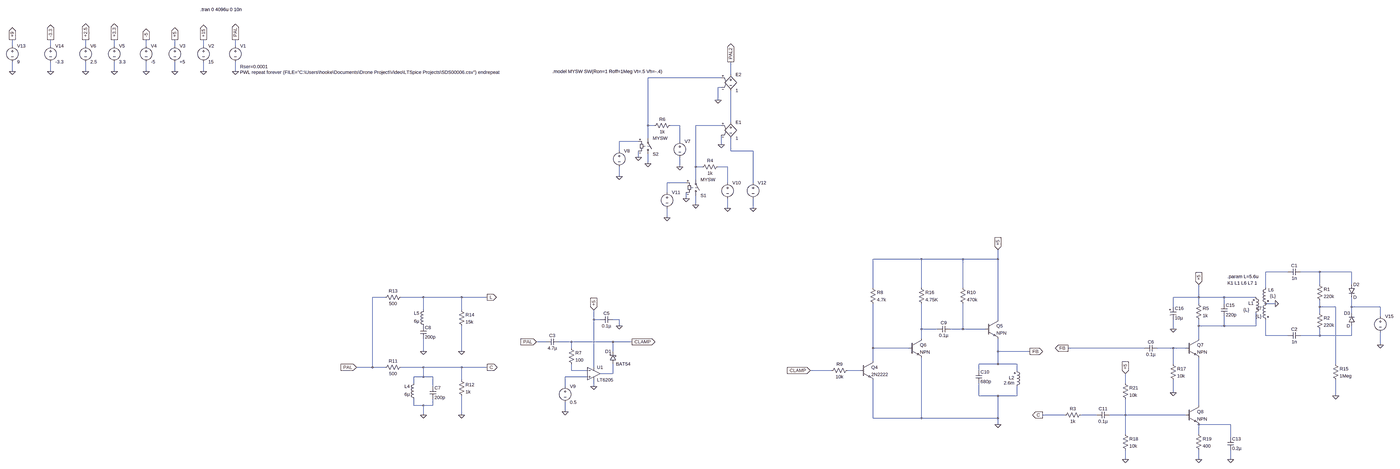
[diagram p0: schematic Burst_Pulse_Seperation.asc, whole sheet]
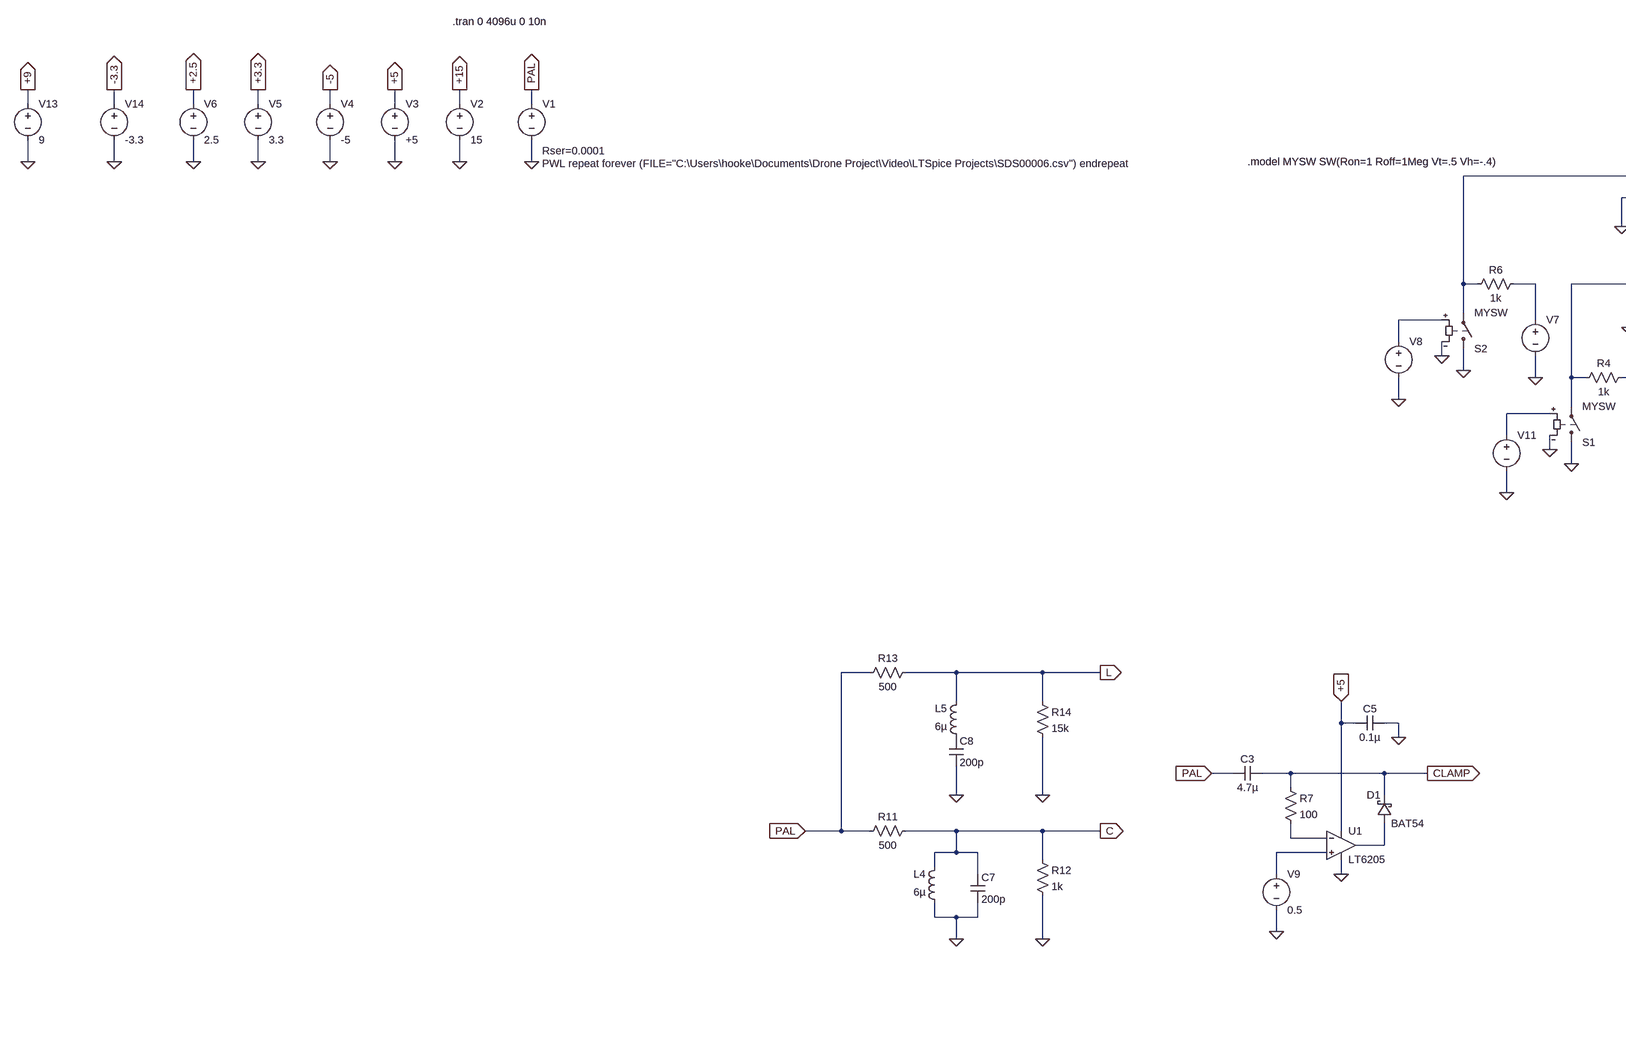
[diagram p1: schematic Burst_Pulse_Seperation.asc, part, row 1 of 1, column 1 of 2]
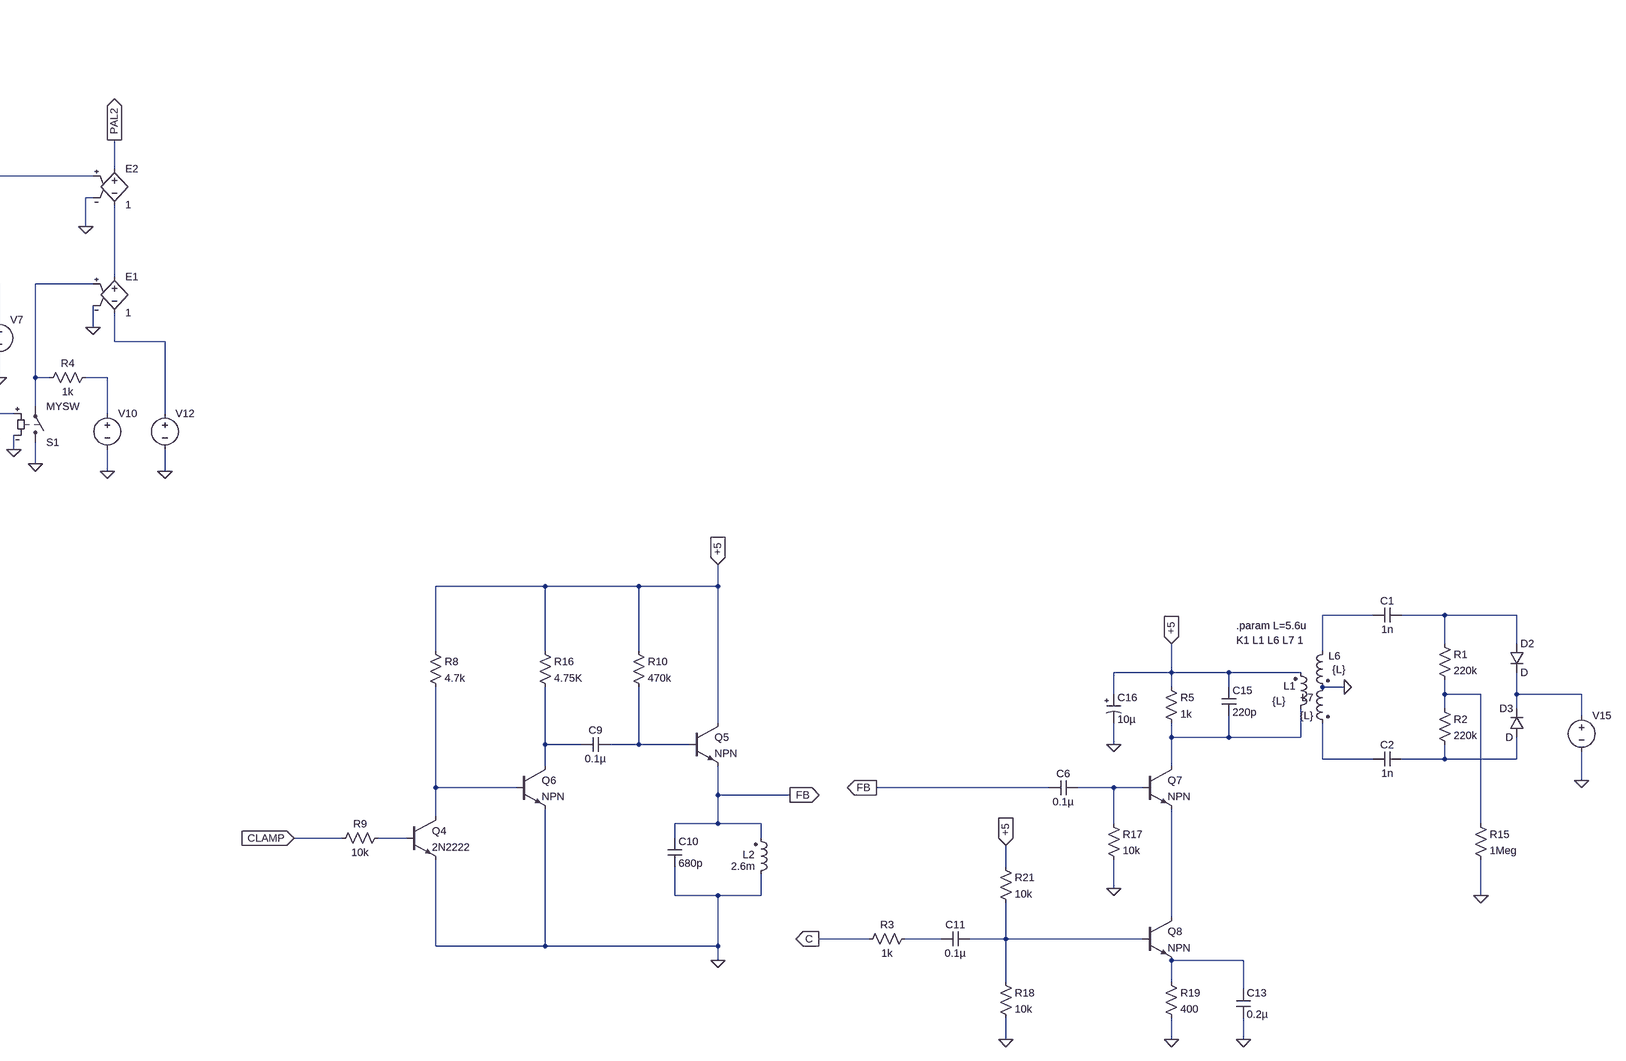
[diagram p2: schematic Burst_Pulse_Seperation.asc, part, row 1 of 1, column 2 of 2]
Burst_Pulse_Seperation.asc, the LTspice schematic file:
Version 4
SHEET 1 5768 2052
WIRE -2752 -704 -2752 -736
WIRE -2560 -704 -2560 -736
WIRE -2384 -704 -2384 -736
WIRE -2240 -704 -2240 -736
WIRE -2080 -704 -2080 -736
WIRE -1936 -704 -1936 -736
WIRE -1792 -704 -1792 -736
WIRE -1632 -704 -1632 -736
WIRE -2752 -576 -2752 -624
WIRE -2560 -576 -2560 -624
WIRE -2384 -576 -2384 -624
WIRE -2240 -576 -2240 -624
WIRE -2080 -576 -2080 -624
WIRE -1936 -576 -1936 -624
WIRE -1792 -576 -1792 -624
WIRE -1632 -576 -1632 -624
WIRE 1264 -560 1264 -624
WIRE 1216 -544 848 -544
WIRE 1216 -496 1200 -496
WIRE 1200 -432 1200 -496
WIRE 1264 -320 1264 -480
WIRE 848 -304 848 -544
WIRE 880 -304 848 -304
WIRE 1008 -304 960 -304
WIRE 1216 -304 1088 -304
WIRE 848 -240 848 -304
WIRE 800 -224 704 -224
WIRE 1008 -224 1008 -304
WIRE 1216 -208 1216 -256
WIRE 704 -176 704 -224
WIRE 1264 -176 1264 -240
WIRE 1376 -176 1264 -176
WIRE 800 -144 800 -176
WIRE 848 -112 848 -160
WIRE 1008 -96 1008 -144
WIRE 1088 -96 1088 -304
WIRE 1120 -96 1088 -96
WIRE 1248 -96 1200 -96
WIRE 704 -48 704 -96
WIRE 1088 -32 1088 -96
WIRE 1040 -16 944 -16
WIRE 1248 -16 1248 -96
WIRE 1376 -16 1376 -176
WIRE 944 32 944 -16
WIRE 1040 64 1040 32
WIRE 1088 96 1088 48
WIRE 1248 112 1248 64
WIRE 1376 112 1376 64
WIRE 944 160 944 112
WIRE 3280 368 3008 368
WIRE 3488 368 3280 368
WIRE 3664 368 3664 320
WIRE 3664 368 3488 368
WIRE 5120 432 5008 432
WIRE 5280 432 5184 432
WIRE 5440 432 5280 432
WIRE 5280 496 5280 432
WIRE 5440 496 5440 432
WIRE 3008 512 3008 368
WIRE 3280 512 3280 368
WIRE 3488 512 3488 368
WIRE 5008 512 5008 432
WIRE -880 560 -944 560
WIRE -688 560 -800 560
WIRE -496 560 -688 560
WIRE -368 560 -496 560
WIRE 4672 560 4672 496
WIRE 4672 560 4544 560
WIRE 4800 560 4672 560
WIRE 4960 560 4800 560
WIRE 4672 592 4672 560
WIRE 4800 592 4800 560
WIRE 5056 592 5008 592
WIRE 4544 608 4544 560
WIRE 5280 608 5280 576
WIRE 5360 608 5280 608
WIRE 5440 608 5440 560
WIRE 5584 608 5440 608
WIRE -688 624 -688 560
WIRE -496 624 -496 560
WIRE 5280 640 5280 608
WIRE 5440 640 5440 608
WIRE 5584 656 5584 608
WIRE 576 672 576 624
WIRE 608 672 576 672
WIRE 704 672 672 672
WIRE 3664 672 3664 368
WIRE 704 704 704 672
WIRE 4672 704 4672 672
WIRE 4800 704 4800 656
WIRE 4800 704 4672 704
WIRE 4960 704 4960 640
WIRE 4960 704 4800 704
WIRE 3280 720 3280 592
WIRE 3360 720 3280 720
WIRE 3488 720 3488 592
WIRE 3488 720 3424 720
WIRE 3600 720 3488 720
WIRE 4544 720 4544 672
WIRE 5008 752 5008 672
WIRE 5120 752 5008 752
WIRE 5280 752 5280 720
WIRE 5280 752 5184 752
WIRE 5440 752 5440 704
WIRE 5440 752 5280 752
WIRE 3280 768 3280 720
WIRE 4672 768 4672 704
WIRE 336 784 288 784
WIRE 464 784 400 784
WIRE 672 784 464 784
WIRE 768 784 672 784
WIRE 5584 800 5584 736
WIRE 464 816 464 784
WIRE 3008 816 3008 592
WIRE 3216 816 3008 816
WIRE 4400 816 4016 816
WIRE 4544 816 4464 816
WIRE 4608 816 4544 816
WIRE -688 832 -688 768
WIRE -496 832 -496 704
WIRE 672 832 672 784
WIRE 3664 832 3664 768
WIRE 3824 832 3664 832
WIRE 3008 880 3008 816
WIRE 3664 896 3664 832
WIRE 3664 896 3568 896
WIRE 3760 896 3664 896
WIRE 4544 896 4544 816
WIRE 5360 896 5360 608
WIRE -944 912 -944 560
WIRE -944 912 -1024 912
WIRE -880 912 -944 912
WIRE -688 912 -800 912
WIRE -496 912 -688 912
WIRE -368 912 -496 912
WIRE 576 912 576 672
WIRE 464 928 464 896
WIRE 544 928 464 928
WIRE 2800 928 2688 928
WIRE 2944 928 2880 928
WIRE 3568 928 3568 896
WIRE 3760 928 3760 896
WIRE 672 944 672 896
WIRE 672 944 608 944
WIRE -688 960 -688 912
WIRE -688 960 -736 960
WIRE -640 960 -688 960
WIRE 544 960 432 960
WIRE -496 976 -496 912
WIRE -736 992 -736 960
WIRE 4304 992 4304 944
WIRE -640 1008 -640 960
WIRE 432 1008 432 960
WIRE 576 1008 576 976
WIRE 4544 1040 4544 976
WIRE 3568 1056 3568 992
WIRE 3664 1056 3568 1056
WIRE 3760 1056 3760 1008
WIRE 3760 1056 3664 1056
WIRE 5360 1056 5360 976
WIRE -736 1104 -736 1072
WIRE -688 1104 -736 1104
WIRE -640 1104 -640 1072
WIRE -640 1104 -688 1104
WIRE 4672 1104 4672 864
WIRE 432 1136 432 1088
WIRE -688 1152 -688 1104
WIRE -496 1152 -496 1056
WIRE 4000 1152 3888 1152
WIRE 4160 1152 4080 1152
WIRE 4304 1152 4304 1072
WIRE 4304 1152 4224 1152
WIRE 4608 1152 4304 1152
WIRE 3008 1168 3008 976
WIRE 3280 1168 3280 864
WIRE 3280 1168 3008 1168
WIRE 3664 1168 3664 1056
WIRE 3664 1168 3280 1168
WIRE 3664 1200 3664 1168
WIRE 4832 1200 4672 1200
WIRE 4304 1248 4304 1152
WIRE 4672 1248 4672 1200
WIRE 4832 1264 4832 1200
WIRE 4304 1376 4304 1328
WIRE 4672 1376 4672 1328
WIRE 4832 1376 4832 1328
FLAG -688 1152 0
FLAG -688 832 0
FLAG -496 1152 0
FLAG -496 832 0
FLAG -368 560 L
IOPIN -368 560 Out
FLAG -368 912 C
IOPIN -368 912 Out
FLAG -1632 -736 PAL
IOPIN -1632 -736 Out
FLAG -1632 -576 0
FLAG -1792 -736 +15
IOPIN -1792 -736 Out
FLAG -1792 -576 0
FLAG -1936 -736 +5
IOPIN -1936 -736 Out
FLAG -1936 -576 0
FLAG -2080 -736 -5
IOPIN -2080 -736 Out
FLAG -2080 -576 0
FLAG -2240 -736 +3.3
IOPIN -2240 -736 Out
FLAG -2240 -576 0
FLAG -2384 -736 +2.5
IOPIN -2384 -736 Out
FLAG -2384 -576 0
FLAG 1248 112 0
FLAG 1040 64 0
FLAG 944 160 0
FLAG 1088 96 0
FLAG 1216 -208 0
FLAG 1376 112 0
FLAG 1264 -624 PAL2
IOPIN 1264 -624 Out
FLAG -2560 -736 -3.3
IOPIN -2560 -736 Out
FLAG -2560 -576 0
FLAG 1008 -96 0
FLAG 800 -144 0
FLAG 704 -48 0
FLAG 848 -112 0
FLAG 1200 -432 0
FLAG 704 704 0
FLAG 576 1008 0
FLAG 288 784 PAL
IOPIN 288 784 In
FLAG 576 624 +5
IOPIN 576 624 In
FLAG 432 1136 0
FLAG -1024 912 PAL
IOPIN -1024 912 In
FLAG -2752 -736 +9
IOPIN -2752 -736 Out
FLAG -2752 -576 0
FLAG 3664 320 +5
IOPIN 3664 320 In
FLAG 3664 1200 0
FLAG 3824 832 FB
IOPIN 3824 832 Out
FLAG 768 784 CLAMP
IOPIN 768 784 Out
FLAG 2688 928 CLAMP
IOPIN 2688 928 In
FLAG 4016 816 FB
IOPIN 4016 816 Out
FLAG 4544 1040 0
FLAG 4304 1376 0
FLAG 4672 1376 0
FLAG 3888 1152 C
IOPIN 3888 1152 Out
FLAG 4672 496 +5
IOPIN 4672 496 In
FLAG 4304 944 +5
IOPIN 4304 944 In
FLAG 5056 592 0
FLAG 4832 1376 0
FLAG 4544 720 0
FLAG 5584 800 0
FLAG 5360 1056 0
SYMBOL ind -720 1088 R180
WINDOW 0 36 80 Left 2
WINDOW 3 36 40 Left 2
SYMATTR InstName L4
SYMATTR Value 6µ
SYMBOL cap -656 1008 R0
SYMATTR InstName C7
SYMATTR Value 200p
SYMBOL res -784 896 R90
WINDOW 0 0 56 VBottom 2
WINDOW 3 32 56 VTop 2
SYMATTR InstName R11
SYMATTR Value 500
SYMBOL res -512 960 R0
SYMATTR InstName R12
SYMATTR Value 1k
SYMBOL res -784 544 R90
WINDOW 0 0 56 VBottom 2
WINDOW 3 32 56 VTop 2
SYMATTR InstName R13
SYMATTR Value 500
SYMBOL ind -672 720 R180
WINDOW 0 36 80 Left 2
WINDOW 3 36 40 Left 2
SYMATTR InstName L5
SYMATTR Value 6µ
SYMBOL cap -704 704 R0
SYMATTR InstName C8
SYMATTR Value 200p
SYMBOL res -512 608 R0
SYMATTR InstName R14
SYMATTR Value 15k
SYMBOL voltage -1632 -720 R0
WINDOW 39 23 120 Left 2
WINDOW 3 23 148 Left 2
SYMATTR SpiceLine Rser=0.0001
SYMATTR Value PWL repeat forever (FILE="C:\Users\hooke\Documents\Drone Project\Video\LTSpice Projects\SDS00006.csv") endrepeat
SYMATTR InstName V1
SYMBOL voltage -1792 -720 R0
WINDOW 123 0 0 Left 0
WINDOW 39 0 0 Left 0
SYMATTR InstName V2
SYMATTR Value 15
SYMBOL voltage -1936 -720 R0
WINDOW 123 0 0 Left 0
WINDOW 39 0 0 Left 0
SYMATTR InstName V3
SYMATTR Value +5
SYMBOL voltage -2080 -720 R0
WINDOW 123 0 0 Left 0
WINDOW 39 0 0 Left 0
SYMATTR InstName V4
SYMATTR Value -5
SYMBOL voltage -2240 -720 R0
WINDOW 123 0 0 Left 0
WINDOW 39 0 0 Left 0
SYMATTR InstName V5
SYMATTR Value 3.3
SYMBOL voltage -2384 -720 R0
WINDOW 123 0 0 Left 0
WINDOW 39 0 0 Left 0
SYMATTR InstName V6
SYMATTR Value 2.5
SYMBOL voltage 1248 -32 R0
WINDOW 3 24 96 Invisible 2
WINDOW 123 0 0 Left 0
WINDOW 39 0 0 Left 0
SYMATTR Value SINE(0 280m 4.43Meg 0 0 0)
SYMATTR InstName V10
SYMBOL sw 1088 64 M180
SYMATTR InstName S1
SYMATTR Value MYSW
SYMBOL voltage 944 16 R0
WINDOW 3 24 96 Invisible 2
WINDOW 123 0 0 Left 0
WINDOW 39 0 0 Left 0
SYMATTR Value PULSE(1 0 6.6u 1u 1u 1.2u 64u)
SYMATTR InstName V11
SYMBOL res 1216 -112 R90
WINDOW 0 0 56 VBottom 2
WINDOW 3 32 56 VTop 2
SYMATTR InstName R4
SYMATTR Value 1k
SYMBOL e 1264 -336 R0
SYMATTR InstName E1
SYMATTR Value 1
SYMBOL voltage 1376 -32 R0
WINDOW 3 24 96 Invisible 2
SYMATTR Value PWL repeat forever (FILE="C:\Users\hooke\Documents\Drone Project\Video\LTSpice Projects\PAL-LUMA.csv") endrepeat
SYMATTR InstName V12
SYMBOL voltage -2560 -720 R0
WINDOW 123 0 0 Left 0
WINDOW 39 0 0 Left 0
SYMATTR InstName V14
SYMATTR Value -3.3
SYMBOL voltage 1008 -240 R0
WINDOW 3 24 96 Invisible 2
WINDOW 123 0 0 Left 0
WINDOW 39 0 0 Left 0
SYMATTR Value SINE(0 300m 4.43Meg 0 0 0)
SYMATTR InstName V7
SYMBOL sw 848 -144 M180
SYMATTR InstName S2
SYMATTR Value MYSW
SYMBOL voltage 704 -192 R0
WINDOW 3 24 96 Invisible 2
WINDOW 123 0 0 Left 0
WINDOW 39 0 0 Left 0
SYMATTR Value PULSE(1 0 10.5u 1u 1u 52u 64u)
SYMATTR InstName V8
SYMBOL res 976 -320 R90
WINDOW 0 0 56 VBottom 2
WINDOW 3 32 56 VTop 2
SYMATTR InstName R6
SYMATTR Value 1k
SYMBOL e 1264 -576 R0
SYMATTR InstName E2
SYMATTR Value 1
SYMBOL cap 400 768 R90
WINDOW 0 0 32 VBottom 2
WINDOW 3 32 32 VTop 2
SYMATTR InstName C3
SYMATTR Value 4.7µ
SYMBOL cap 672 656 R90
WINDOW 0 0 32 VBottom 2
WINDOW 3 32 32 VTop 2
SYMATTR InstName C5
SYMATTR Value 0.1µ
SYMATTR SpiceLine V=4 Irms=0 Rser=0 Lser=0 mfg="Murata" pn="GRM022R60G333KE15" type="X5R"
SYMBOL Opamps\\LT6205 576 944 R0
SYMATTR InstName U1
SYMBOL res 448 800 R0
SYMATTR InstName R7
SYMATTR Value 100
SYMATTR SpiceLine tol=1 pwr=0.1
SYMBOL schottky 688 896 R180
WINDOW 0 24 64 Left 2
WINDOW 3 -73 0 Left 2
SYMATTR InstName D1
SYMATTR Value BAT54
SYMATTR Description Diode
SYMATTR Type diode
SYMBOL npn 2944 880 R0
SYMATTR InstName Q4
SYMATTR Value 2N2222
SYMBOL res 2992 496 R0
SYMATTR InstName R8
SYMATTR Value 4.7k
SYMATTR SpiceLine tol=1 pwr=0.1
SYMBOL voltage 432 992 R0
WINDOW 123 0 0 Left 0
WINDOW 39 0 0 Left 0
SYMATTR InstName V9
SYMATTR Value 0.5
SYMBOL res 2896 912 R90
WINDOW 0 0 56 VBottom 2
WINDOW 3 32 56 VTop 2
SYMATTR InstName R9
SYMATTR Value 10k
SYMATTR SpiceLine tol=1 pwr=0.1
SYMBOL cap 3424 704 R90
WINDOW 0 0 32 VBottom 2
WINDOW 3 32 32 VTop 2
SYMATTR InstName C9
SYMATTR Value 0.1µ
SYMATTR SpiceLine V=4 Irms=0 Rser=0 Lser=0 mfg="Murata" pn="GRM022R60G333KE15" type="X5R"
SYMBOL res 3472 496 R0
SYMATTR InstName R10
SYMATTR Value 470k
SYMBOL voltage -2752 -720 R0
WINDOW 123 0 0 Left 0
WINDOW 39 0 0 Left 0
SYMATTR InstName V13
SYMATTR Value 9
SYMBOL cap 3552 928 R0
SYMATTR InstName C10
SYMATTR Value 680p
SYMATTR SpiceLine V=6.3 Irms=17.5m Rser=5.03579 Lser=0 mfg="KEMET" pn="C0402C681K9RAC" type="X7R"
SYMBOL ind2 3744 1024 M180
WINDOW 0 -25 59 Left 2
WINDOW 3 -51 33 Left 2
SYMATTR InstName L2
SYMATTR Value 2.6m
SYMATTR Type ind
SYMATTR SpiceLine Ipk=0.024 Rser=11 Rpar=631701 Cpar=0
SYMBOL npn 3600 672 R0
SYMATTR InstName Q5
SYMBOL npn 3216 768 R0
SYMATTR InstName Q6
SYMBOL res 3264 496 R0
SYMATTR InstName R16
SYMATTR Value 4.75K
SYMATTR SpiceLine tol=1 pwr=0.1
SYMBOL npn 4608 768 R0
SYMATTR InstName Q7
SYMBOL cap 4464 800 R90
WINDOW 0 0 32 VBottom 2
WINDOW 3 32 32 VTop 2
SYMATTR InstName C6
SYMATTR Value 0.1µ
SYMBOL res 4528 880 R0
SYMATTR InstName R17
SYMATTR Value 10k
SYMBOL npn 4608 1104 R0
SYMATTR InstName Q8
SYMBOL cap 4224 1136 R90
WINDOW 0 0 32 VBottom 2
WINDOW 3 32 32 VTop 2
SYMATTR InstName C11
SYMATTR Value 0.1µ
SYMBOL res 4288 1232 R0
SYMATTR InstName R18
SYMATTR Value 10k
SYMBOL res 4656 1232 R0
SYMATTR InstName R19
SYMATTR Value 400
SYMBOL res 4288 976 R0
SYMATTR InstName R21
SYMATTR Value 10k
SYMBOL ind2 4944 656 M180
WINDOW 0 -23 66 Left 2
WINDOW 3 -48 33 Left 2
SYMATTR InstName L1
SYMATTR Value {L}
SYMATTR Type ind
SYMATTR SpiceLine Ipk=0.35 Rser=0.15 Rpar=0 Cpar=0
SYMBOL ind2 5024 496 M0
WINDOW 0 -24 27 Left 2
WINDOW 3 -36 57 Left 2
SYMATTR InstName L6
SYMATTR Value {L}
SYMATTR Type ind
SYMATTR SpiceLine Ipk=0.35 Rser=0.15 Rpar=0 Cpar=0
SYMBOL ind2 5024 576 M0
SYMATTR InstName L7
SYMATTR Value {L}
SYMATTR Type ind
SYMATTR SpiceLine Ipk=0.35 Rser=0.15
SYMBOL cap 5184 416 R90
WINDOW 0 0 32 VBottom 2
WINDOW 3 32 32 VTop 2
SYMATTR InstName C1
SYMATTR Value 1n
SYMBOL cap 5184 736 R90
WINDOW 0 0 32 VBottom 2
WINDOW 3 32 32 VTop 2
SYMATTR InstName C2
SYMATTR Value 1n
SYMBOL res 5264 480 R0
SYMATTR InstName R1
SYMATTR Value 220k
SYMBOL res 5264 624 R0
SYMATTR InstName R2
SYMATTR Value 220k
SYMBOL diode 5424 496 R0
SYMATTR InstName D2
SYMBOL voltage 5584 640 R0
WINDOW 3 24 96 Invisible 2
WINDOW 123 0 0 Left 0
WINDOW 39 0 0 Left 0
SYMATTR Value SINE(0 3 4.43Meg 0 0 0)
SYMATTR InstName V15
SYMBOL cap 4816 1264 R0
SYMATTR InstName C13
SYMATTR Value 0.2µ
SYMBOL cap 4784 592 R0
SYMATTR InstName C15
SYMATTR Value 220p
SYMBOL res 4656 576 R0
SYMATTR InstName R5
SYMATTR Value 1k
SYMBOL polcap 4528 608 R0
SYMATTR InstName C16
SYMATTR Value 10µ
SYMBOL diode 5456 704 R180
WINDOW 0 24 64 Left 2
WINDOW 3 24 0 Left 2
SYMATTR InstName D3
SYMBOL res 4096 1136 R90
WINDOW 0 0 56 VBottom 2
WINDOW 3 32 56 VTop 2
SYMATTR InstName R3
SYMATTR Value 1k
SYMBOL res 5344 880 R0
SYMATTR InstName R15
SYMATTR Value 1Meg
TEXT -1808 -888 Left 2 !.tran 0 4096u 0 10n
TEXT 368 -576 Left 2 !.model MYSW SW(Ron=1 Roff=1Meg Vt=.5 Vh=-.4)
TEXT 4816 488 Left 2 !K1 L1 L6 L7 1
TEXT 4816 456 Left 2 !.param L=5.6u

The netlist it stands for:
* Burst_Pulse_Seperation.asc
L4 0 C 6µ
C7 C 0 200p
R11 C PAL 500
R12 C 0 1k
R13 L PAL 500
L5 P001 L 6µ
C8 P001 0 200p
R14 L 0 15k
V1 PAL 0 PWL repeat forever (FILE="C:\Users\hooke\Documents\Drone Project\Video\LTSpice Projects\SDS00006.csv") endrepeat Rser=0.0001
V2 +15 0 15
V3 +5 0 +5
V4 -5 0 -5
V5 +3.3 0 3.3
V6 +2.5 0 2.5
V10 N007 0 SINE(0 280m 4.43Meg 0 0 0)
S1 0 N004 N008 0 MYSW
V11 N008 0 PULSE(1 0 6.6u 1u 1u 1.2u 64u)
R4 N007 N004 1k
E1 N002 N006 N004 0 1
V12 N006 0 PWL repeat forever (FILE="C:\Users\hooke\Documents\Drone Project\Video\LTSpice Projects\PAL-LUMA.csv") endrepeat
V14 -3.3 0 -3.3
V7 N003 0 SINE(0 300m 4.43Meg 0 0 0)
S2 0 N001 N005 0 MYSW
V8 N005 0 PULSE(1 0 10.5u 1u 1u 52u 64u)
R6 N003 N001 1k
E2 PAL2 N002 N001 0 1
C3 CLAMP PAL 4.7µ
C5 0 +5 0.1µ V=4 Irms=0 Rser=0 Lser=0 mfg="Murata" pn="GRM022R60G333KE15" type="X5R"
* U1: LT6205 (symbol Opamps\LT6205 not available, pins judged from their places): In+=N023 In-=N020 V+=+5 V-=0 OUT=N022
R7 CLAMP N020 100 tol=1 pwr=0.1
D1 N022 CLAMP BAT54
Q4 N018 N021 0 0 2N2222
R8 +5 N018 4.7k tol=1 pwr=0.1
V9 N023 0 0.5
R9 N021 CLAMP 10k tol=1 pwr=0.1
C9 N015 N014 0.1µ V=4 Irms=0 Rser=0 Lser=0 mfg="Murata" pn="GRM022R60G333KE15" type="X5R"
R10 +5 N015 470k
V13 +9 0 9
C10 FB 0 680p V=6.3 Irms=17.5m Rser=5.03579 Lser=0 mfg="KEMET" pn="C0402C681K9RAC" type="X7R"
L2 0 FB 2.6m Ipk=0.024 Rser=11 Rpar=631701 Cpar=0
Q5 +5 N015 FB 0 NPN
Q6 N014 N018 0 0 NPN
R16 +5 N014 4.75K tol=1 pwr=0.1
Q7 N013 N019 N024 0 NPN
C6 N019 FB 0.1µ
R17 N019 0 10k
Q8 N024 N026 N027 0 NPN
C11 N026 N025 0.1µ
R18 N026 0 10k
R19 N027 0 400
R21 +5 N026 10k
L1 N013 +5 {L} Ipk=0.35 Rser=0.15 Rpar=0 Cpar=0
L6 N009 0 {L} Ipk=0.35 Rser=0.15 Rpar=0 Cpar=0
L7 0 N016 {L} Ipk=0.35 Rser=0.15
C1 N010 N009 1n
C2 N017 N016 1n
R1 N010 N011 220k
R2 N011 N017 220k
D2 N010 N012 D
V15 N012 0 SINE(0 3 4.43Meg 0 0 0)
C13 N027 0 0.2µ
C15 +5 N013 220p
R5 +5 N013 1k
C16 +5 0 10µ
D3 N017 N012 D
R3 N025 C 1k
R15 N011 0 1Meg
.model D D
.lib standard.dio
.model NPN NPN
.model PNP PNP
.lib standard.bjt
.tran 0 4096u 0 10n
.model MYSW SW(Ron=1 Roff=1Meg Vt=.5 Vh=-.4)
K1 L1 L6 L7 1
.param L=5.6u
.backanno
.end